# Altium schematic sheet four_axis_part2.SchDoc
size A4
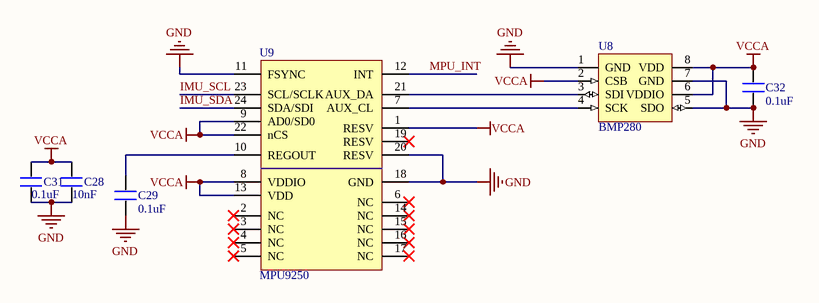
[diagram p0: four_axis_part2.SchDoc]

## Parts
C28  10nF  [0603P]
C29  0.1uF  [0603P]
C31  0.1uF  [0603P]
C32  0.1uF  [0603P]
U8  BMP280  [LGA-8]
U9  MPU9250  [QFN24-0.4]

## Nets
GND: C28.1 C29.1 C31.1 C32.1 U8.1(GND) U8.5(SDO) U8.7(GND) U9.11(FSYNC) U9.18(GND) U9.20(RESV)
VCCA: C28.2 C31.2 C32.2 U8.2(CSB) U8.6(VDDIO) U8.8(VDD) U9.1(RESV) U9.8(VDDIO) U9.9(AD0/SD0) U9.13(VDD) U9.22(nCS)
IMU_SCL: U9.23(SCL/SCLK)
IMU_SDA: U9.24(SDA/SDI)
MPU_INT: U9.12(INT)
NetC29_2: C29.2 U9.10(REGOUT)
NetU8_3: U8.3(SDI) U9.21(AUX_DA)
NetU8_4: U8.4(SCK) U9.7(AUX_CL)

Not connected (* = marked no-connect by the designer): U9 2(NC)* 3(NC)* 4(NC)* 5(NC)* 6(NC)* 14(NC)* 15(NC)* 16(NC)* 17(NC)* 19(RESV)*

## Library data of the parts
C28 C29 C31 C32 = C